# Altium schematic sheet Amplifier2ch.SchDoc
size A4; PageSetup: Record=PageOptions|CenterHorizontal=True|CenterVertical=True|PrintScale=0.97|XCorrection=1.00|YCorrection=1.00|PrintKind=2|BorderSize=5000000|LeftOffset=0|BottomOffset=0|Orientation=2|PaperLength=1270|PaperWidth=1000|Scale=100|PaperSource=4|PrintQuality=600|MediaType=1|DitherType=10|PaperKind=A4|PrintScaleMode=1
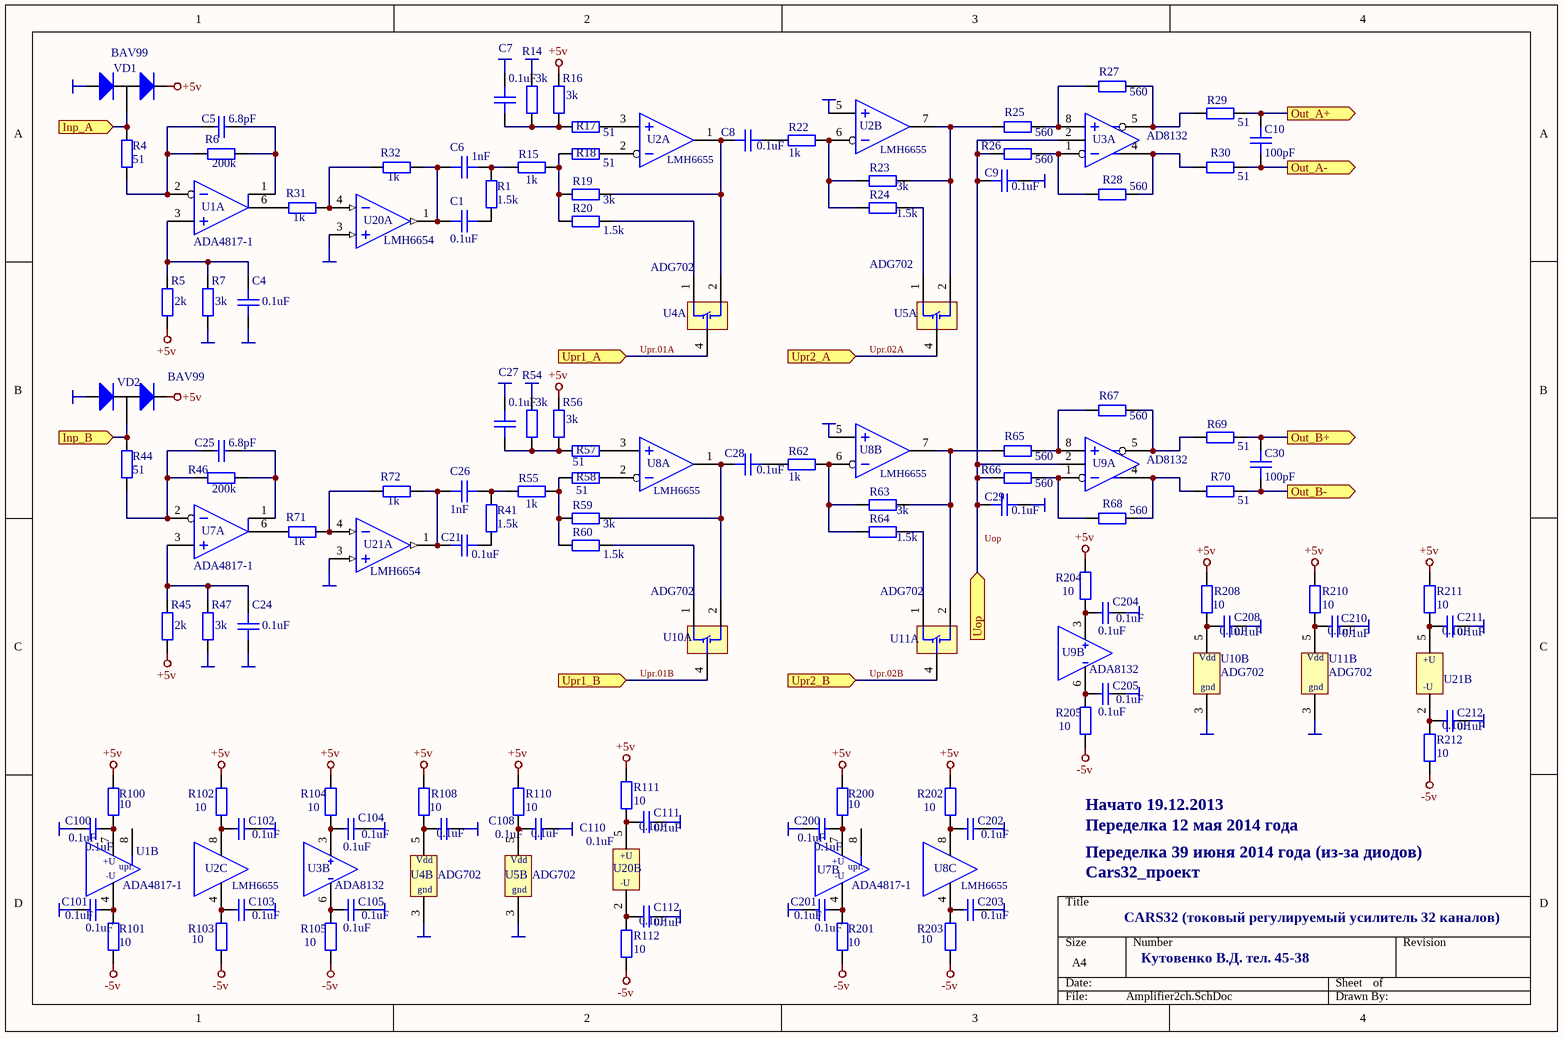
[diagram p0: Amplifier2ch.SchDoc]

## Parts
C1  0.1uF  [0603]
C4  0.1uF  [0603]
C5  6.8pF  [0603]
C6  1nF  [0603]
C7  0.1uF  [0603]
C8  0.1uF  [0603]
C9  0.1uF  [0603]
C10  100pF  [0603]
C21  0.1uF  [0603]
C24  0.1uF  [0603]
C25  6.8pF  [0603]
C26  1nF  [0603]
C27  0.1uF  [0603]
C28  0.1uF  [0603]
C29  0.1uF  [0603]
C30  100pF  [0603]
C100  0.1uF  [0603]
C101  0.1uF  [0603]
C102  0.1uF  [0603]
C103  0.1uF  [0603]
C104  0.1uF  [0603]
C105  0.1uF  [0603]
C108  0.1uF  [0603]
C110  0.1uF  [0603]
C111  0.1uF  [0603]
C112  0.1uF  [0603]
C200  0.1uF  [0603]
C201  0.1uF  [0603]
C202  0.1uF  [0603]
C203  0.1uF  [0603]
C204  0.1uF  [0603]
C205  0.1uF  [0603]
C208  0.1uF  [0603]
C210  0.1uF  [0603]
C211  0.1uF  [0603]
C212  0.1uF  [0603]
R1  1.5k  [0603]
R4  51  [0603]
R5  2k  [0603]
R6  200k  [0603]
R7  3k  [0603]
R14  3k  [0603]
R15  1k  [0603]
R16  3k  [0603]
R17  51  [0603]
R18  51  [0603]
R19  3k  [0603]
R20  1.5k  [0603]
R22  1k  [0603]
R23  3k  [0603]
R24  1.5k  [0603]
R25  560  [0603]
R26  560  [0603]
R27  560  [0603]
R28  560  [0603]
R29  51  [0603]
R30  51  [0603]
R31  1k  [0603]
R32  1k  [0603]
R41  1.5k  [0603]
R44  51  [0603]
R45  2k  [0603]
R46  200k  [0603]
R47  3k  [0603]
R54  3k  [0603]
R55  1k  [0603]
R56  3k  [0603]
R57  51  [0603]
R58  51  [0603]
R59  3k  [0603]
R60  1.5k  [0603]
R62  1k  [0603]
R63  3k  [0603]
R64  1.5k  [0603]
R65  560  [0603]
R66  560  [0603]
R67  560  [0603]
R68  560  [0603]
R69  51  [0603]
R70  51  [0603]
R71  1k  [0603]
R72  1k  [0603]
R100  10  [0603]
R101  10  [0603]
R102  10  [0603]
R103  10  [0603]
R104  10  [0603]
R105  10  [0603]
R108  10  [0603]
R110  10  [0603]
R111  10  [0603]
R112  10  [0603]
R200  10  [0603]
R201  10  [0603]
R202  10  [0603]
R203  10  [0603]
R204  10  [0603]
R205  10  [0603]
R208  10  [0603]
R210  10  [0603]
R211  10  [0603]
R212  10  [0603]
U1  ADA4817-1  [8SOIC150]  (parts A,B of 2)
U2  LMH6655  [8SOIC150]  (parts A,B,C of 3)
U3  AD8132  [8SOIC150]  (parts A,B of 2)
U4  ADG702  [SOT-23-5]  (parts A,B of 2)
U5  ADG702  [SOT-23-5]  (parts A,B of 2)
U7  ADA4817-1  [8SOIC150]  (parts A,B of 2)
U8  LMH6655  [8SOIC150]  (parts A,B,C of 3)
U9  AD8132  [8SOIC150]  (parts A,B of 2)
U10  ADG702  [SOT-23-5]  (parts A,B of 2)
U11  ADG702  [SOT-23-5]  (parts A,B of 2)
U20  LMH6654  [SOT-23-5]  (parts A,B of 2)
U21  LMH6654  [SOT-23-5]  (parts A,B of 2)
VD1  BAV99  [SOT-23]
VD2  BAV99  [SOT-23]

## Ports
Inp_A (in), Inp_B (in), Out_A+ (out), Out_A- (out), Out_B+ (out), Out_B- (out), Uop (in), Upr1_A (in), Upr1_B (in), Upr2_A (in), Upr2_B (in)

## Nets
+5v: R5.2 R16.2 R45.2 R56.2 R100.2 R102.2 R104.2 R108.2 R110.2 R111.2 R200.2 R202.2 R204.2 R208.2 R210.2 R211.2 VD1.2(K) VD2.2(K)
-5v: R101.1 R103.1 R105.1 R112.1 R201.1 R203.1 R205.1 R212.1
AGND: C4.1 C7.2 C9.1 C24.1 C27.2 C29.1 R7.1 R14.2 R47.1 R54.2 U2.5(IN+) U8.5(IN+) U20.3(IN+) U21.3(IN+) VD1.1(A) VD2.1(A)
GND: C100.1 C101.1 C102.2 C103.2 C104.2 C105.2 C108.1 C110.1 C111.1 C112.1 C200.1 C201.1 C202.2 C203.2 C204.2 C205.2 C208.1 C210.1 C211.1 C212.1 U4.3(GND) U5.3(GND) U10.3(GND) U11.3(GND)
Inp_A: R4.1 VD1.3(C) ; port Inp_A
Inp_B: R44.2 VD2.3(C) ; port Inp_B
Out_A+: C10.2 R29.2 ; port Out_A+
Out_A-: C10.1 R30.2 ; port Out_A-
Out_B+: C30.2 R69.2 ; port Out_B+
Out_B-: C30.1 R70.2 ; port Out_B-
Uop: C9.2 C29.2 R26.1 R66.1 U3.2 U9.2 ; port Uop
Upr.01A: U4.4(IN) ; port Upr1_A
Upr.01B: U10.4(IN) ; port Upr1_B
Upr.02A: U5.4(IN) ; port Upr2_A
Upr.02B: U11.4(IN) ; port Upr2_B
NetC1_1: C1.1 R1.2
NetC1_2: C1.2 C6.2 R32.2 U20.1(OUT)
NetC4_2: C4.2 R5.1 R7.2 U1.3(IN+)
NetC5_1: C5.1 R4.2 R6.1 U1.2(IN-)
NetC5_2: C5.2 R6.2 U1.1
NetC6_1: C6.1 R1.1 R15.1
NetC7_1: C7.1 R14.1 R16.1 R17.1
NetC8_1: C8.1 R19.2 U2.1(OUT) U4.2(S)
NetC8_2: C8.2 R22.1
NetC21_1: C21.1 C26.1 R72.2 U21.1(OUT)
NetC21_2: C21.2 R41.1
NetC24_2: C24.2 R45.1 R47.2 U7.3(IN+)
NetC25_1: C25.1 R44.1 R46.1 U7.2(IN-)
NetC25_2: C25.2 R46.2 U7.1
NetC26_2: C26.2 R41.2 R55.1
NetC27_1: C27.1 R54.1 R56.1 R57.2
NetC28_1: C28.1 R59.2 U8.1(OUT) U10.2(S)
NetC28_2: C28.2 R62.1
NetC100_2: C100.2 R100.1 U1.7(V+)
NetC101_2: C101.2 R101.2 U1.4(V-)
NetC102_1: C102.1 R102.1 U2.8(V+)
NetC103_1: C103.1 R103.2 U2.4(V-)
NetC104_1: C104.1 R104.1 U3.3(V+)
NetC105_1: C105.1 R105.2 U3.6(V-)
NetC108_2: C108.2 R108.1 U4.5(VDD)
NetC110_2: C110.2 R110.1 U5.5(VDD)
NetC111_2: C111.2 R111.1 U20.5(VDD)
NetC112_2: C112.2 R112.2 U20.2(GND)
NetC200_2: C200.2 R200.1 U7.7(V+)
NetC201_2: C201.2 R201.2 U7.4(V-)
NetC202_1: C202.1 R202.1 U8.8(V+)
NetC203_1: C203.1 R203.2 U8.4(V-)
NetC204_1: C204.1 R204.1 U9.3(V+)
NetC205_1: C205.1 R205.2 U9.6(V-)
NetC208_2: C208.2 R208.1 U10.5(VDD)
NetC210_2: C210.2 R210.1 U11.5(VDD)
NetC211_2: C211.2 R211.1 U21.5(VDD)
NetC212_2: C212.2 R212.2 U21.2(GND)
NetR15_2: R15.2 R18.1 R19.1 R20.1
NetR17_2: R17.2 U2.3(IN+)
NetR18_2: R18.2 U2.2(IN-)
NetR20_2: R20.2 U4.1(D)
NetR22_2: R22.2 R23.1 R24.1 U2.6(IN-)
NetR23_2: R23.2 R25.1 U2.7(OUT) U5.2(S)
NetR24_2: R24.2 U5.1(D)
NetR25_2: R25.2 R27.1 U3.8(IN+)
NetR26_2: R26.2 R28.1 U3.1(IN-)
NetR27_2: R27.2 R29.1 U3.5(OUT+)
NetR28_2: R28.2 R30.1 U3.4(OUT)
NetR31_1: R31.1 U1.6(OUT)
NetR31_2: R31.2 R32.1 U20.4(IN-)
NetR55_2: R55.2 R58.1 R59.1 R60.1
NetR57_1: R57.1 U8.3(IN+)
NetR58_2: R58.2 U8.2(IN-)
NetR60_2: R60.2 U10.1(D)
NetR62_2: R62.2 R63.1 R64.1 U8.6(IN-)
NetR63_2: R63.2 R65.1 U8.7(OUT) U11.2(S)
NetR64_2: R64.2 U11.1(D)
NetR65_2: R65.2 R67.1 U9.8(IN+)
NetR66_2: R66.2 R68.1 U9.1(IN-)
NetR67_2: R67.2 R69.1 U9.5(OUT+)
NetR68_2: R68.2 R70.1 U9.4(OUT)
NetR71_1: R71.1 U7.6(OUT)
NetR71_2: R71.2 R72.1 U21.4(IN-)

Not connected (* = marked no-connect by the designer): U1 8; U7 8

## Notes on the sheet
- Начато 19.12.2013
- Переделка 12 мая 2014 года
- Cars32_проект
- Переделка 39 июня 2014 года (из-за диодов)
- CARS32 (токовый регулируемый усилитель 32 каналов)
- Кутовенко В.Д. тел. 45-38
- Labels drawn without touching a wire or pin: Uop
- (in symbol ADA4817-1, part B) +U; upr.; -U
- (in symbol ADG702, part B) Vdd; gnd
- (in symbol LMH6654, part B) +U; -U

## Library data of the parts
C1 C4 C6-C10 C21 C24 C26-C30 = C
  C1 C4 C7-C9 C21 C24 C27-C29: Value: 0.1uF
  C6 C26: Value: 1nF
  C10 C30: Value: 100pF
C5 C25 C100-C105 C108 C110-C112 C200-C205 C208 C210-C212 = Cap: Capacitor; Published: 8-Jun-2000; LatestRevisionDate: 17-Jul-2002; LatestRevisionNote: Re-released for DXP Platform.; PackageReference: RAD-0.3; Publisher: Altium Limited
  C5 C25: Value: 6.8pF
  C100-C105 C108 C110-C112 C200-C205 C208 C210-C212: Value: 0.1uF
R1 R4-R7 R14-R20 R22-R32 R41 R44-R47 R54-R60 R62-R72 R100-R105 R108 R110-R112 R200-R205 R208 R210-R212 = Res2: Resistor; Published: 8-Jun-2000; LatestRevisionDate: 17-Jul-2002; LatestRevisionNote: Re-released for DXP Platform.; PackageReference: AXIAL-0.4; Publisher: Altium Limited
  R1 R20 R24 R41 R60 R64: Value: 1.5k
  R4 R17 R18 R29 R30 R44 R57 R58 R69 R70: Value: 51
  R5 R45: Value: 2k
  R6 R46: Value: 200k
  R7 R14 R16 R19 R23 R47 R54 R56 R59 R63: Value: 3k
  R15 R22 R31 R32 R55 R62 R71 R72: Value: 1k
  R25-R28 R65-R68: Value: 560
  R100-R105 R108 R110-R112 R200-R205 R208 R210-R212: Value: 10
U1 U7 = ADA4817-1: Value: ADA4817-1
U2 U8 = LMH6655: Value: LMH6655
U3 U9 = AD8132: Value: AD8132; Published: 15-Apr-2002; LatestRevisionDate: 6-Jun-2005; LatestRevisionNote: Stylized 3D Model Added.; DatasheetDocument: Apr-1998; PackageDocument: Sep-1997; PackageReference: M08A; Publisher: Altium Limited; Code_JEDEC: MS-012-AA; Code_IPC: SO8; ComponentLink1Description: Manufacturer Link; ComponentLink1URL: http://www.national.com/
U4 U5 U10 U11 = ADG702: Value: ADG702
U20 U21 = LMH6654: Value: LMH6654
VD1 VD2 = BAV99: Value: BAV99